# Altium schematic sheet i2c_sensors.SchDoc
size A4; SheetNumber: 7; SheetTotal: 13
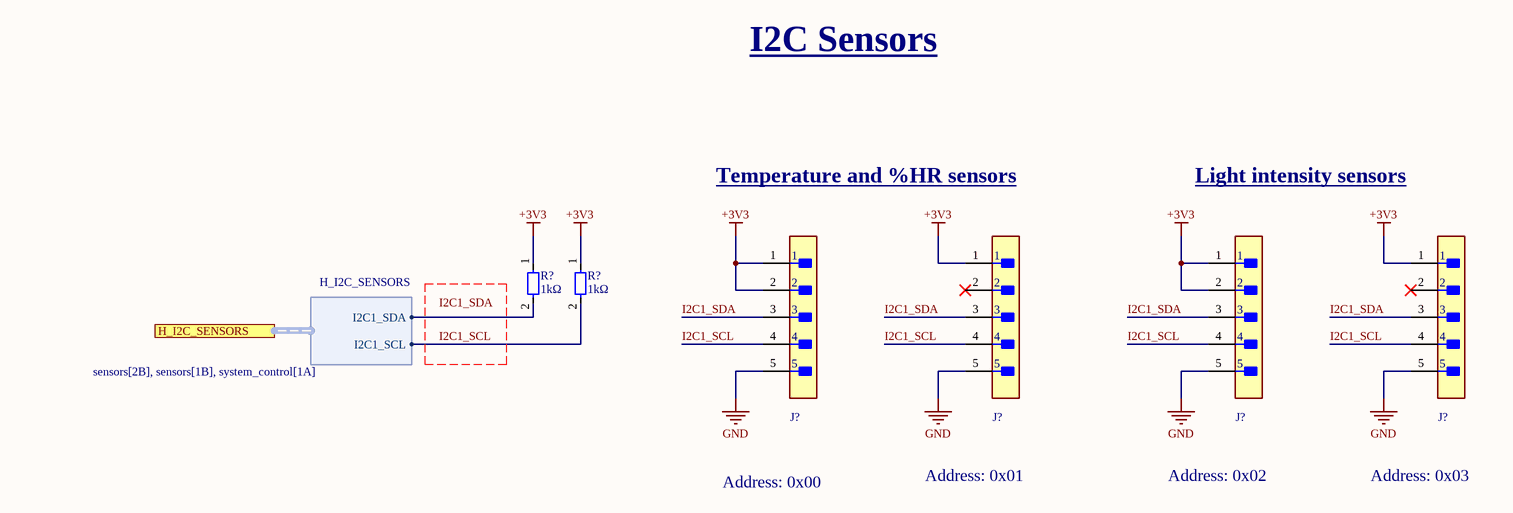
[diagram p0: i2c_sensors.SchDoc]

## Parts
(Parts that share a designator on the sheet are numbered #1, #2 ... from top to bottom, then left to right.)
J?#1  0022272051  [CONN_MOLEX_KK_5POS_2,54]  (value not drawn)
J?#2  0022272051  [CONN_MOLEX_KK_5POS_2,54]  (value not drawn)
J?#3  0022272051  [CONN_MOLEX_KK_5POS_2,54]  (value not drawn)
J?#4  0022272051  [CONN_MOLEX_KK_5POS_2,54]  (value not drawn)
R?#1  value 1kΩ  [RES_0805]  (hidden comment: Simbolo de resistencia genérica)
R?#2  value 1kΩ  [RES_0805]  (hidden comment: Simbolo de resistencia genérica)

## Ports
H_I2C_SENSORS (harness H_I2C_SENSORS, see sensors[2B], sensors[1B], system_control[1A])

## Harnesses
H_I2C_SENSORS: I2C1_SDA, I2C1_SCL

## Nets
+3V3: J?#1.1 J?#1.2 J?#2.1 J?#3.1 J?#3.2 J?#4.1 R?#1.1 R?#2.1
GND: J?#1.5 J?#2.5 J?#3.5 J?#4.5
I2C1_SCL: J?#1.4 J?#2.4 J?#3.4 J?#4.4 R?#2.2 ; port H_I2C_SENSORS.I2C1_SCL
I2C1_SDA: J?#1.3 J?#2.3 J?#3.3 J?#4.3
NetR?#1_2: R?#1.2 ; port H_I2C_SENSORS.I2C1_SDA

Not connected (* = marked no-connect by the designer): J?#2 2*; J?#4 2*

## Notes on the sheet
- I2C Sensors
- Temperature and %HR sensors
- Light intensity sensors
- Address: 0x00
- Address: 0x01
- Address: 0x02
- Address: 0x03
- Labels drawn without touching a wire or pin: I2C1_SDA

## Library data of the parts
J?#1-J?#4 = CONN_MOLEX_KK_5POS_2,54MM: CONN HEADER VERT 5POS 2.54MM MOLEX KK; Insulation Resistance: 50GR; Voltage Rating: 250V; Glow Wire Compliant: Non-compliant; Max Current Rating: 4A; Number of Circuits: 5; Contact Resistance: 10mR; Gender: Male; Number of Lines: 1; Length: 10.16mm; Radiation Hardening: No; Pitch: 2.54mm; Contact Material: Brass; Height: 11.7mm; Max Operating Temperature: 75°C; Flammability Rating: UL94 V-0; Mount: Through Hole; Voltage Rating (DC): 250V; Halogen Free: Low Halogen; Housing Color: White; Package Quantity: 1500; Series: KK® 6410; Number of Rows: 1; Housing Material: Nylon; Depth: 5.8mm; RoHS Compliant: Yes; Orientation: Straight; Contact Gender: Male; Color: Natural; Current Rating: 4A; Contact Mating Length: 0.295inch; Number of Poles: 5; Packaging: Bulk; Contact Type: Male Pin; Termination: Solder; Number of Positions: 5; Number of Contacts: 5; Lead Free: Lead Free; Min Operating Temperature: 0°C; Fastening Type: Friction; Contact Plating: Gold
R?#1 R?#2 = Generic R